# Altium schematic sheet 05_LEDs.SchDoc: ECE315 Analog
size A; Date: 4/25/2017; ApprovedBy: JSK; CheckedBy: JSK; Author: JSK; CompanyName: University of Wisconsin; DrawnBy: JSK; Engineer: JSK; Organization: ECE 315; Address1: College of Engineering; Address2: 1415 Engineering Drive; Address3: Madison, WI 53706; Address4: ECE 315 Fall 2017; Revision: A; SheetNumber: 2; SheetTotal: 2; AssemblyNumber: ECE315-F19; ApprovedDate: 04/02/2019
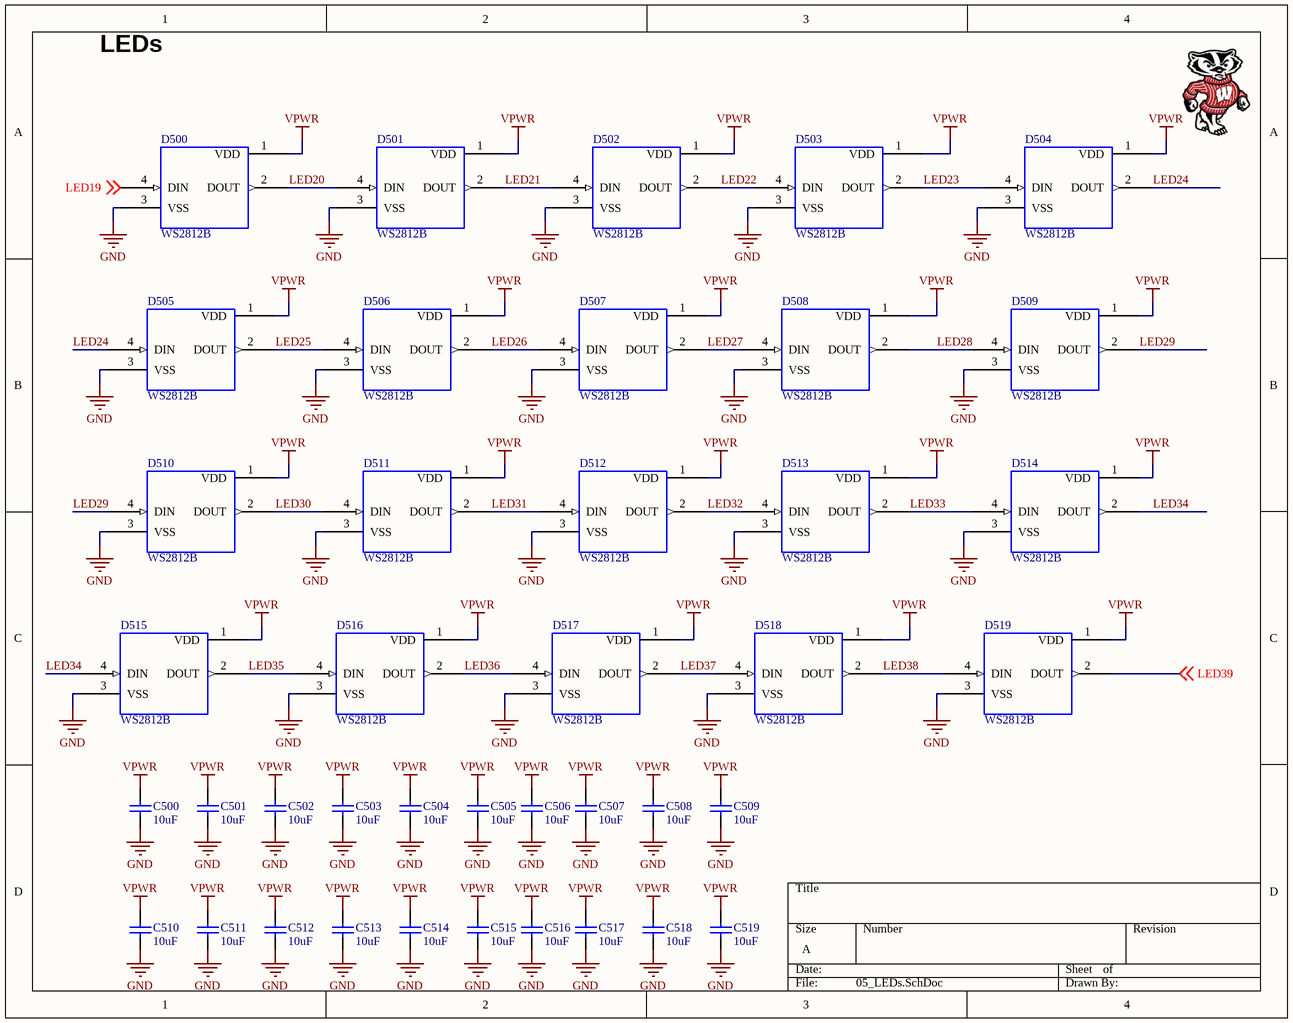
[diagram p0: 05_LEDs.SchDoc]

## Parts
C500  10uF  [CAP_0805]
C501  10uF  [CAP_0805]
C502  10uF  [CAP_0805]
C503  10uF  [CAP_0805]
C504  10uF  [CAP_0805]
C505  10uF  [CAP_0805]
C506  10uF  [CAP_0805]
C507  10uF  [CAP_0805]
C508  10uF  [CAP_0805]
C509  10uF  [CAP_0805]
C510  10uF  [CAP_0805]
C511  10uF  [CAP_0805]
C512  10uF  [CAP_0805]
C513  10uF  [CAP_0805]
C514  10uF  [CAP_0805]
C515  10uF  [CAP_0805]
C516  10uF  [CAP_0805]
C517  10uF  [CAP_0805]
C518  10uF  [CAP_0805]
C519  10uF  [CAP_0805]
D500  WS2812B  [WS2812B]
D501  WS2812B  [WS2812B]
D502  WS2812B  [WS2812B]
D503  WS2812B  [WS2812B]
D504  WS2812B  [WS2812B]
D505  WS2812B  [WS2812B]
D506  WS2812B  [WS2812B]
D507  WS2812B  [WS2812B]
D508  WS2812B  [WS2812B]
D509  WS2812B  [WS2812B]
D510  WS2812B  [WS2812B]
D511  WS2812B  [WS2812B]
D512  WS2812B  [WS2812B]
D513  WS2812B  [WS2812B]
D514  WS2812B  [WS2812B]
D515  WS2812B  [WS2812B]
D516  WS2812B  [WS2812B]
D517  WS2812B  [WS2812B]
D518  WS2812B  [WS2812B]
D519  WS2812B  [WS2812B]

## Nets
GND: C500.1 C501.1 C502.1 C503.1 C504.1 C505.1 C506.1 C507.1 C508.1 C509.1 C510.1 C511.1 C512.1 C513.1 C514.1 C515.1 C516.1 C517.1 C518.1 C519.1 D500.3(VSS) D501.3(VSS) D502.3(VSS) D503.3(VSS) D504.3(VSS) D505.3(VSS) D506.3(VSS) D507.3(VSS) D508.3(VSS) D509.3(VSS) D510.3(VSS) D511.3(VSS) D512.3(VSS) D513.3(VSS) D514.3(VSS) D515.3(VSS) D516.3(VSS) D517.3(VSS) D518.3(VSS) D519.3(VSS)
VPWR: C500.2 C501.2 C502.2 C503.2 C504.2 C505.2 C506.2 C507.2 C508.2 C509.2 C510.2 C511.2 C512.2 C513.2 C514.2 C515.2 C516.2 C517.2 C518.2 C519.2 D500.1(VDD) D501.1(VDD) D502.1(VDD) D503.1(VDD) D504.1(VDD) D505.1(VDD) D506.1(VDD) D507.1(VDD) D508.1(VDD) D509.1(VDD) D510.1(VDD) D511.1(VDD) D512.1(VDD) D513.1(VDD) D514.1(VDD) D515.1(VDD) D516.1(VDD) D517.1(VDD) D518.1(VDD) D519.1(VDD)
LED19: D500.4(DIN) ; off-sheet LED19
LED20: D500.2(DOUT) D501.4(DIN)
LED21: D501.2(DOUT) D502.4(DIN)
LED22: D502.2(DOUT) D503.4(DIN)
LED23: D503.2(DOUT) D504.4(DIN)
LED24: D504.2(DOUT) D505.4(DIN)
LED25: D505.2(DOUT) D506.4(DIN)
LED26: D506.2(DOUT) D507.4(DIN)
LED27: D507.2(DOUT) D508.4(DIN)
LED28: D508.2(DOUT) D509.4(DIN)
LED29: D509.2(DOUT) D510.4(DIN)
LED30: D510.2(DOUT) D511.4(DIN)
LED31: D511.2(DOUT) D512.4(DIN)
LED32: D512.2(DOUT) D513.4(DIN)
LED33: D513.2(DOUT) D514.4(DIN)
LED34: D514.2(DOUT) D515.4(DIN)
LED35: D515.2(DOUT) D516.4(DIN)
LED36: D516.2(DOUT) D517.4(DIN)
LED37: D517.2(DOUT) D518.4(DIN)
LED38: D518.2(DOUT) D519.4(DIN)
LED39: D519.2(DOUT) ; off-sheet LED39

## Notes on the sheet
- LEDs

## Library data of the parts
C500-C519 = CAP_0805_U_010.00: CAP CER 10UF 16V X7R 0805; Manufacturer: Samsung; Manufacturer Part Number: CL21A106KPCLQNC; Tolerance: 10%; Voltage Rating: 10V; Dielectric: X5R; ComponentLink3URL: https://datasheet.ciiva.com/26920/getdatasheetpartid-355170-26920201.pdf; ComponentLink3Description: https://datasheet.ciiva.com/26920/getdatasheetpartid-355170-26920201.pdf; Supplier 1: Digi-Key; Stock 1: 40000; Pricing 1: 1=0.22, 10=0.148, 100=0.0749, 500=0.05122, 1000=0.04531 (USD); Mount: Surface Mount; Case/Package: 0805; Case Code (Metric): 2012; Case Code (Imperial): 0805; Contact Plating: Tin; Min Operating Temperature: -55°C; Max Operating Temperature: 85°C; Packaging: Tape and Reel; Package Quantity: 1; Length: 2mm; Height: 0.85mm; Width: 0.049inch; Thickness: 0.037inch; Depth: 1.25mm; Radiation Hardening: No; ComponentLink1URL: https://datasheet.ciiva.com/25730/cl21a106kpclqnc-25730594.pdf; ComponentLink1Description: https://datasheet.ciiva.com/25730/cl21a106kpclqnc-25730594.pdf; Supplier Part Number 1: 1276-2402-1-ND; Capacitance: 10uF
D500-D519 = WS2812B: LED RGB WS2812B; Manufacturer Part Number: EBAY; Rating: 3.5V-5.3V; Value: WS2812B